# Altium schematic sheet AP6212WIFI.SchDoc
size A4
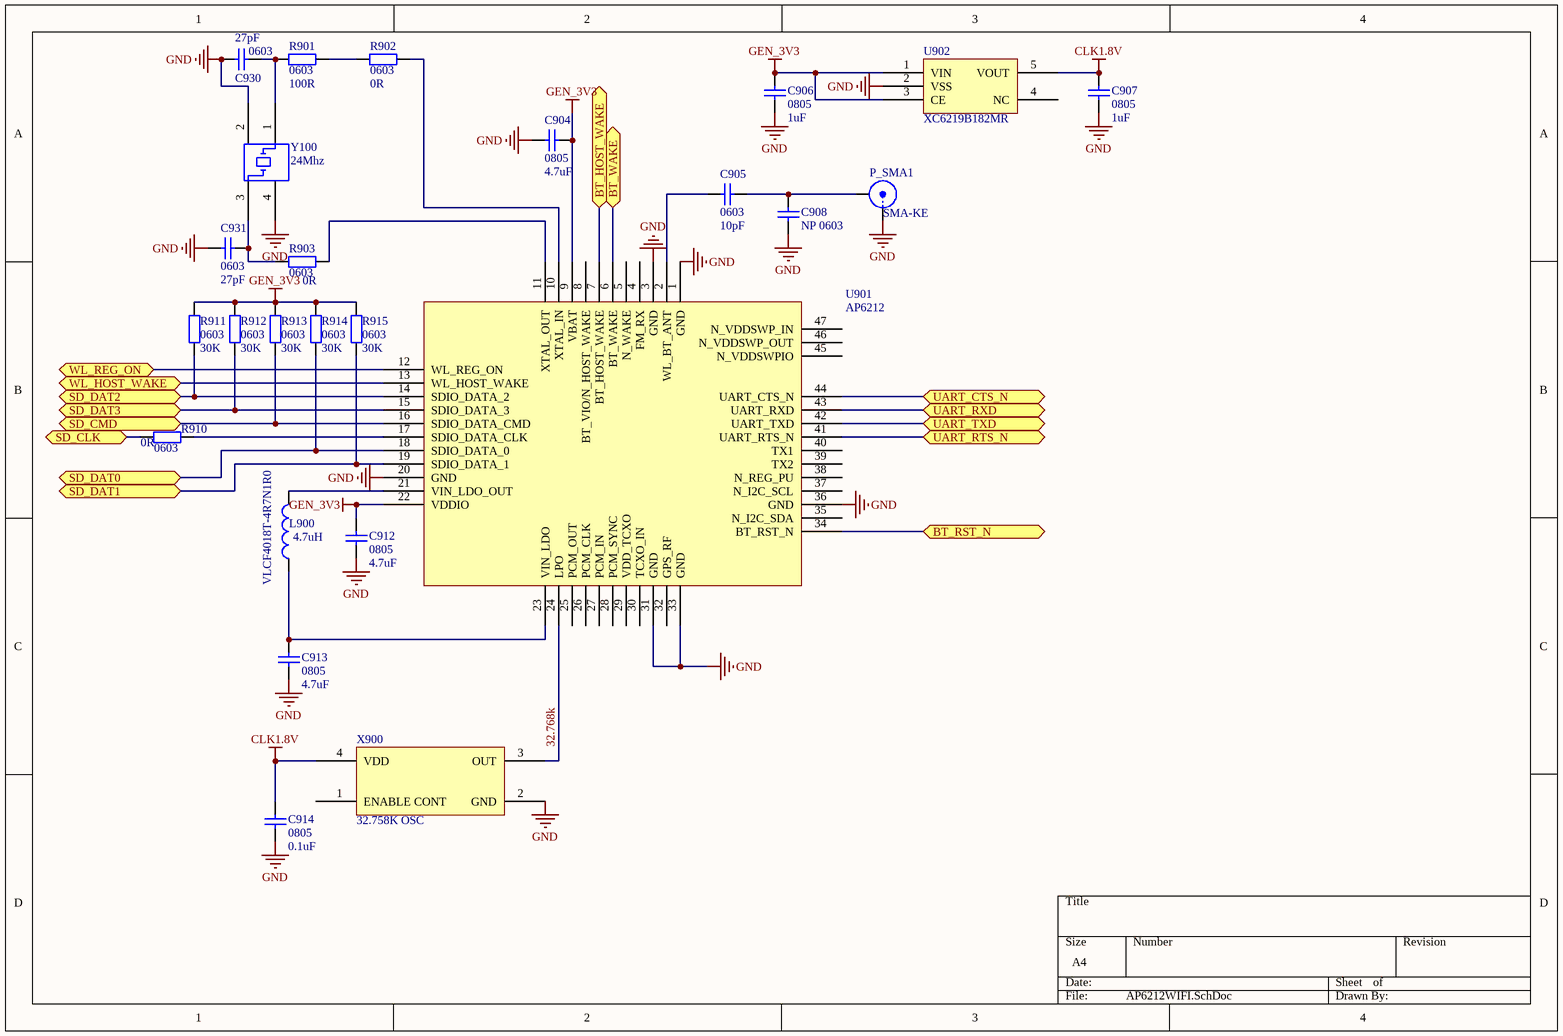
[diagram p0: AP6212WIFI.SchDoc]

## Parts
C904  0805  value 4.7uF  [0805]
C905  0603  value 10pF  [0603]
C906  0805  value 1uF  [0805]
C907  0805  value 1uF  [0805]
C908  NP 0603  [0603]
C912  0805  value 4.7uF  [0805]
C913  0805  value 4.7uF  [0805]
C914  0805  value 0.1uF  [0805]
C930  0603  value 27pF  [0603]
C931  0603  value 27pF  [0603]
L900  VLCF4018T-4R7N1R0  value 4.7uH  [VLCF4018-2-inductor]
P_SMA1  SMA-KE  [2.4Gantenna-IPEX]
R901  0603  value 100R  [0603]
R902  0603  value 0R  [0603]
R903  0603  value 0R  [0603]
R910  0603  value 0R  [0603]
R911  0603  value 30K  [0603]
R912  0603  value 30K  [0603]
R913  0603  value 30K  [0603]
R914  0603  value 30K  [0603]
R915  0603  value 30K  [0603]
U901  AP6212  [AP6212-LCC44]
U902  XC6219B182MR  [XC6219B182MR-SOT-25]
X900  32.758K OSC  [32.768K OSC]
Y100  24Mhz  [XTL571300LLI24.000-10TR]

## Ports
BT_HOST_WAKE, BT_RST_N, BT_WAKE, SD_CLK, SD_CMD, SD_DAT0, SD_DAT1, SD_DAT2, SD_DAT3, UART_CTS_N, UART_RTS_N, UART_RXD, UART_TXD, WL_HOST_WAKE, WL_REG_ON

## Nets
CLK1.8V: C907.2 C914.2 U902.5(VOUT) X900.4(VDD)
GEN_3V3: C904.1 C906.2 C912.2 R911.2 R912.2 R913.2 R914.2 R915.2 U901.9(VBAT) U901.22(VDDIO) U902.1(VIN) U902.3(CE)
GND: C904.2 C906.1 C907.1 C908.2 C912.1 C913.1 C914.1 C930.1 C931.1 P_SMA1.1(X) U901.1(GND) U901.3(GND) U901.20(GND) U901.31(GND) U901.33(GND) U901.36(GND) U902.2(VSS) X900.2(GND) Y100.2 Y100.4
32.768k: U901.24(LPO) X900.3(OUT)
BT_HOST_WAKE: U901.7(BT_HOST_WAKE) ; port BT_HOST_WAKE
BT_RST_N: U901.34(BT_RST_N) ; port BT_RST_N
BT_WAKE: U901.6(BT_WAKE) ; port BT_WAKE
SD_CLK: R910.2 ; port SD_CLK
SD_CMD: R913.1 U901.16(SDIO_DATA_CMD) ; port SD_CMD
SD_DAT0: R914.1 U901.18(SDIO_DATA_0) ; port SD_DAT0
SD_DAT1: R915.1 U901.19(SDIO_DATA_1) ; port SD_DAT1
SD_DAT2: R911.1 U901.14(SDIO_DATA_2) ; port SD_DAT2
SD_DAT3: R912.1 U901.15(SDIO_DATA_3) ; port SD_DAT3
UART_CTS_N: U901.44(UART_CTS_N) ; port UART_CTS_N
UART_RTS_N: U901.41(UART_RTS_N) ; port UART_RTS_N
UART_RXD: U901.43(UART_RXD) ; port UART_RXD
UART_TXD: U901.42(UART_TXD) ; port UART_TXD
WL_HOST_WAKE: U901.13(WL_HOST_WAKE) ; port WL_HOST_WAKE
WL_REG_ON: U901.12(WL_REG_ON) ; port WL_REG_ON
NetC905_1: C905.1 U901.2(WL_BT_ANT)
NetC905_2: C905.2 C908.1 P_SMA1.2(Y)
NetC913_2: C913.2 L900.1 U901.23(VIN_LDO)
NetC930_2: C930.2 R901.1 Y100.1
NetC931_2: C931.2 R903.2 Y100.3
NetL900_2: L900.2 U901.21(VIN_LDO_OUT)
NetR901_2: R901.2 R902.2
NetR902_1: R902.1 U901.10(XTAL_IN)
NetR903_1: R903.1 U901.11(XTAL_OUT)
NetR910_1: R910.1 U901.17(SDIO_DATA_CLK)

Not connected (* = marked no-connect by the designer): U901 4(FM_RX) 5(N_WAKE) 8(BT_VIO/N_HOST_WAKE) 25(PCM_OUT) 26(PCM_CLK) 27(PCM_IN) 28(PCM_SYNC) 29(VDD_TCXO) 30(TCXO_IN) 32(GPS_RF) 35(N_I2C_SDA) 37(N_I2C_SCL) 38(N_REG_PU) 39(TX2) 40(TX1) 45(N_VDDSWPIO) 46(N_VDDSWP_OUT) 47(N_VDDSWP_IN); U902 4(NC); X900 1(ENABLE_CONT)

## Library data of the parts
C904-C907 C912-C914 C930 C931 = Cap: Capacitor; Published: 8-Jun-2000; LatestRevisionDate: 17-Jul-2002; LatestRevisionNote: Re-released for DXP Platform.; PackageReference: RAD-0.3; Publisher: Altium Limited
C908 = Cap: Capacitor; Value: 10pF; Published: 8-Jun-2000; LatestRevisionDate: 17-Jul-2002; LatestRevisionNote: Re-released for DXP Platform.; PackageReference: RAD-0.3; Publisher: Altium Limited
L900 = Inductor: Code_IEC: 1005; Published: 8-Jun-2000; LatestRevisionDate: 29-May-2009; LatestRevisionNote: IPC-7351 Footprint Added.; PackageReference: 0402-A; Publisher: Altium Limited; PackageDescription: Chip Inductor; Code_JEITA: 0402
P_SMA1 = BNC: BNC Elbow Connector; LatestRevisionDate: 17-Jul-2002; LatestRevisionNote: Re-released for DXP Platform.; Publisher: Altium Limited
R901-R903 R910-R915 = Res2: Resistor; Published: 8-Jun-2000; LatestRevisionDate: 17-Jul-2002; LatestRevisionNote: Re-released for DXP Platform.; PackageReference: AXIAL-0.4; Publisher: Altium Limited
Y100 = XTAL